# Altium schematic sheet overallViewSchDoc.SchDoc
size Legal
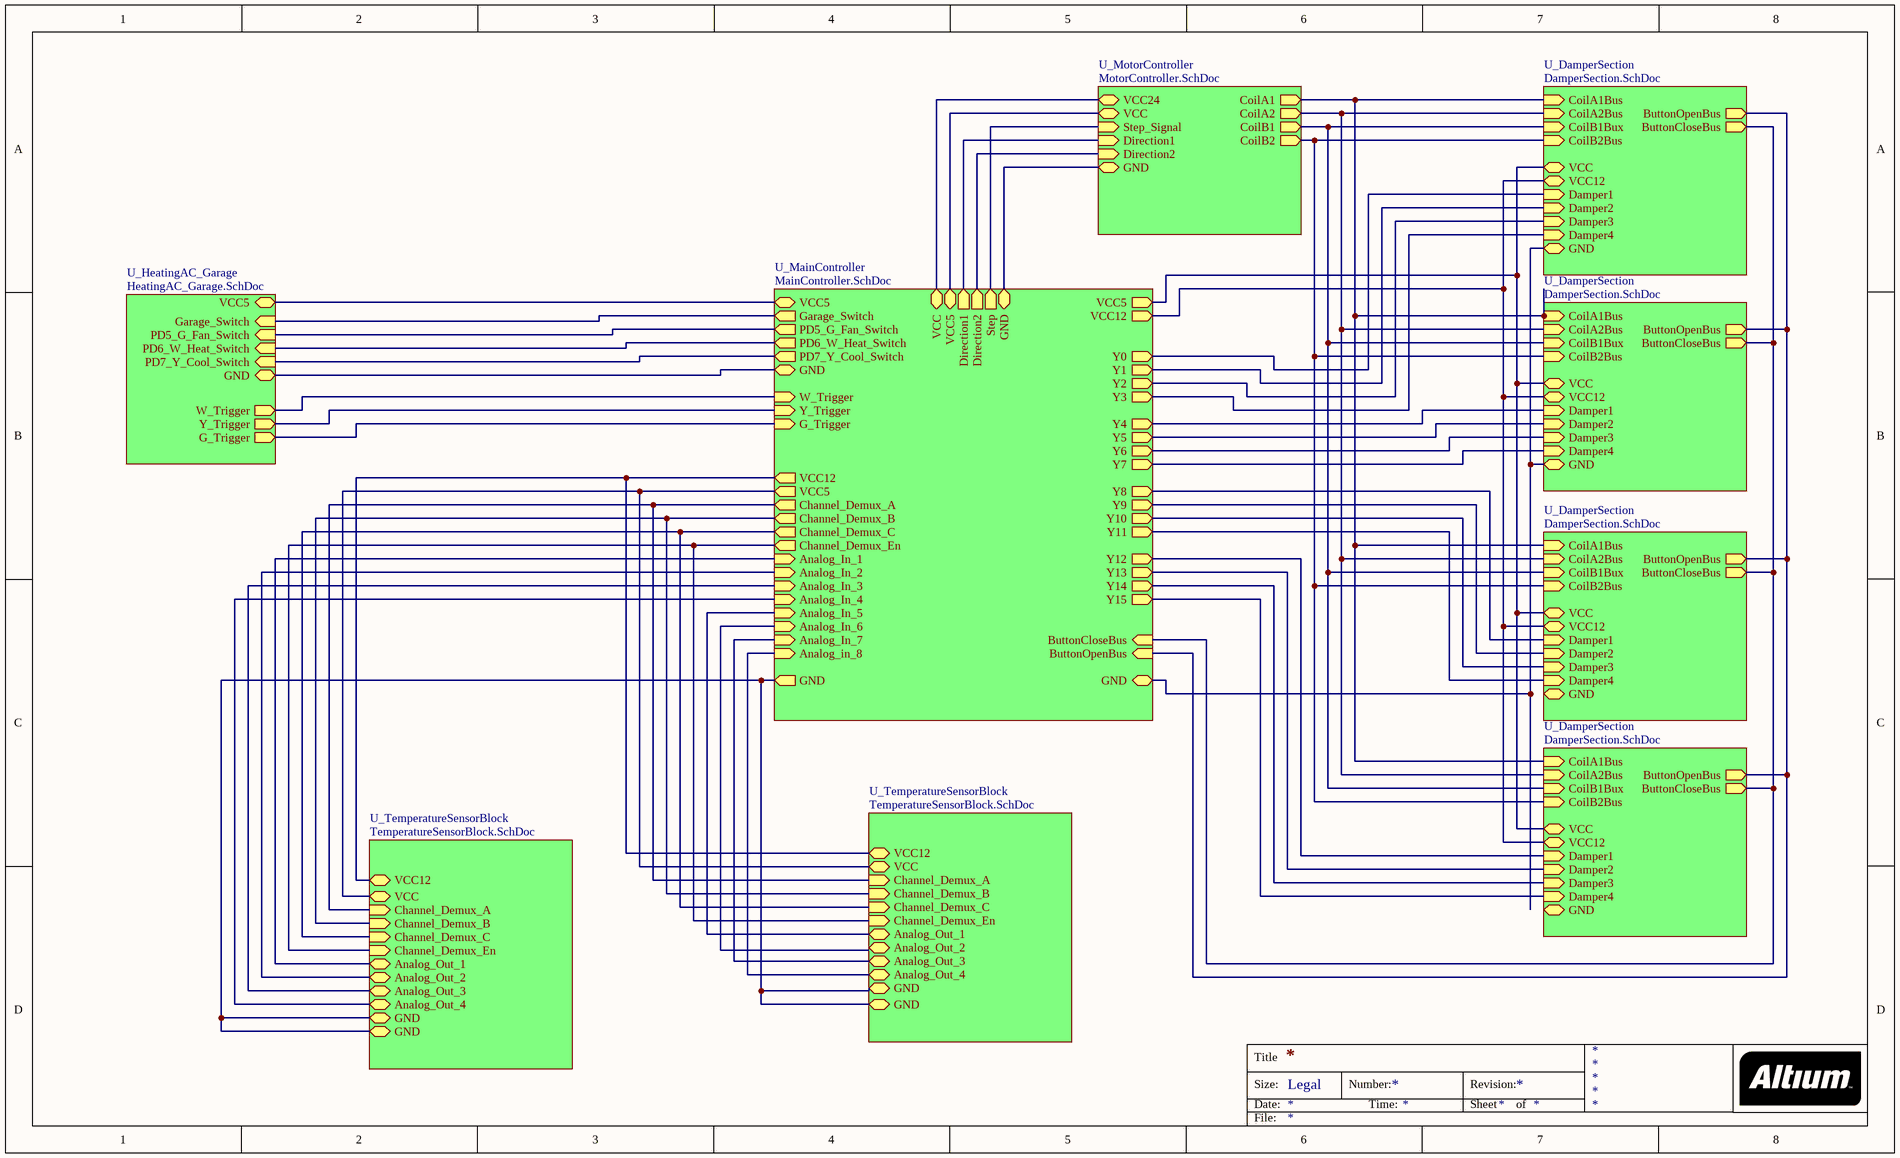
[diagram p0: overallViewSchDoc.SchDoc]

## Sub-sheets
U_DamperSection = DamperSection.SchDoc: CoilA1Bus (in), CoilA2Bus (in), CoilB1Bux (in), CoilB2Bus (in), VCC (bidir), VCC12 (bidir), ButtonOpenBus (out), ButtonCloseBus (out), Damper1 (in), Damper2 (in), Damper3 (in), Damper4 (in), GND (bidir)
U_DamperSection = DamperSection.SchDoc: CoilA1Bus (in), CoilA2Bus (in), CoilB1Bux (in), CoilB2Bus (in), VCC (bidir), VCC12 (bidir), ButtonOpenBus (out), ButtonCloseBus (out), Damper1 (in), Damper2 (in), Damper3 (in), Damper4 (in), GND (bidir)
U_DamperSection = DamperSection.SchDoc: CoilA1Bus (in), CoilA2Bus (in), CoilB1Bux (in), CoilB2Bus (in), VCC (bidir), VCC12 (bidir), ButtonOpenBus (out), ButtonCloseBus (out), Damper1 (in), Damper2 (in), Damper3 (in), Damper4 (in), GND (bidir)
U_DamperSection = DamperSection.SchDoc: CoilA1Bus (in), CoilA2Bus (in), CoilB1Bux (in), CoilB2Bus (in), VCC (bidir), VCC12 (bidir), ButtonOpenBus (out), ButtonCloseBus (out), Damper1 (in), Damper2 (in), Damper3 (in), Damper4 (in), GND (bidir)
U_HeatingAC_Garage = HeatingAC_Garage.SchDoc: VCC5 (bidir), Garage_Switch (in), PD5_G_Fan_Switch (in), PD6_W_Heat_Switch (in), PD7_Y_Cool_Switch (in), GND (bidir), W_Trigger (out), Y_Trigger (out), G_Trigger (out)
U_MainController = MainController.SchDoc: VCC5 (bidir), Garage_Switch (out), PD5_G_Fan_Switch (out), PD6_W_Heat_Switch (out), PD7_Y_Cool_Switch (out), GND (bidir), W_Trigger (in), Y_Trigger (in), G_Trigger (in), ButtonCloseBus (in), VCC (bidir), VCC5 (bidir), Direction1 (out), Direction2 (out), Step (out), GND (bidir), VCC5 (out), VCC12 (out), Y0 (out), Y2 (out), Y3 (out), Y1 (out), Y4 (out), Y5 (out), Y6 (out), Y7 (out), Y8 (out), Y9 (out), Y10 (out), Y11 (out), Y12 (out), Y13 (out), Y14 (out), Y15 (out), ButtonOpenBus (in), GND (bidir), VCC12 (out), VCC5 (out), Channel_Demux_A (out), Channel_Demux_B (out), Channel_Demux_C (out), Channel_Demux_En (out), Analog_In_1 (in), Analog_In_2 (in), Analog_In_3 (in), Analog_In_4 (in), Analog_In_5 (in), Analog_In_6 (in), Analog_In_7 (in), Analog_in_8 (in), GND (out)
U_MotorController = MotorController.SchDoc: VCC24 (bidir), VCC (bidir), Step_Signal (in), Direction1 (in), Direction2 (in), GND (bidir), CoilA1 (out), CoilA2 (out), CoilB1 (out), CoilB2 (out)
U_TemperatureSensorBlock = TemperatureSensorBlock.SchDoc: VCC (bidir), VCC12 (bidir), Channel_Demux_A (in), Channel_Demux_B (in), Channel_Demux_C (in), Channel_Demux_En (in), Analog_Out_1 (bidir), Analog_Out_2 (bidir), Analog_Out_3 (bidir), Analog_Out_4 (bidir), GND (bidir), GND (bidir)
U_TemperatureSensorBlock = TemperatureSensorBlock.SchDoc: VCC (bidir), VCC12 (bidir), Channel_Demux_A (in), Channel_Demux_B (in), Channel_Demux_C (in), Channel_Demux_En (in), Analog_Out_1 (bidir), Analog_Out_2 (bidir), Analog_Out_3 (bidir), Analog_Out_4 (bidir), GND (bidir), GND (bidir)

## Nets
(unnamed): sheet U_MainController/VCC5, sheet U_HeatingAC_Garage/VCC5
(unnamed): sheet U_MainController/Garage_Switch, sheet U_HeatingAC_Garage/Garage_Switch
(unnamed): sheet U_MainController/PD5_G_Fan_Switch, sheet U_HeatingAC_Garage/PD5_G_Fan_Switch
(unnamed): sheet U_MainController/PD6_W_Heat_Switch, sheet U_HeatingAC_Garage/PD6_W_Heat_Switch
(unnamed): sheet U_MainController/PD7_Y_Cool_Switch, sheet U_HeatingAC_Garage/PD7_Y_Cool_Switch
(unnamed): sheet U_MainController/GND, sheet U_HeatingAC_Garage/GND
(unnamed): sheet U_MainController/W_Trigger, sheet U_HeatingAC_Garage/W_Trigger
(unnamed): sheet U_MainController/Y_Trigger, sheet U_HeatingAC_Garage/Y_Trigger
(unnamed): sheet U_MainController/G_Trigger, sheet U_HeatingAC_Garage/G_Trigger
(unnamed): sheet U_MainController/ButtonCloseBus, sheet U_DamperSection/ButtonCloseBus, sheet U_DamperSection/ButtonCloseBus, sheet U_DamperSection/ButtonCloseBus, sheet U_DamperSection/ButtonCloseBus
(unnamed): sheet U_MainController/VCC, sheet U_MotorController/VCC24
(unnamed): sheet U_MainController/VCC5, sheet U_MotorController/VCC
(unnamed): sheet U_MainController/Direction1, sheet U_MotorController/Direction1
(unnamed): sheet U_MainController/Direction2, sheet U_MotorController/Direction2
(unnamed): sheet U_MainController/Step, sheet U_MotorController/Step_Signal
(unnamed): sheet U_MainController/GND, sheet U_MotorController/GND
(unnamed): sheet U_MainController/VCC5, sheet U_DamperSection/VCC, sheet U_DamperSection/VCC, sheet U_DamperSection/VCC, sheet U_DamperSection/VCC
(unnamed): sheet U_MainController/VCC12, sheet U_DamperSection/VCC12, sheet U_DamperSection/VCC12, sheet U_DamperSection/VCC12, sheet U_DamperSection/VCC12
(unnamed): sheet U_MainController/Y0, sheet U_DamperSection/Damper1
(unnamed): sheet U_MainController/Y2, sheet U_DamperSection/Damper3
(unnamed): sheet U_MainController/Y3, sheet U_DamperSection/Damper4
(unnamed): sheet U_MainController/Y1, sheet U_DamperSection/Damper2
(unnamed): sheet U_MainController/Y4, sheet U_DamperSection/Damper1
(unnamed): sheet U_MainController/Y5, sheet U_DamperSection/Damper2
(unnamed): sheet U_MainController/Y6, sheet U_DamperSection/Damper3
(unnamed): sheet U_MainController/Y7, sheet U_DamperSection/Damper4
(unnamed): sheet U_MainController/Y8, sheet U_DamperSection/Damper1
(unnamed): sheet U_MainController/Y9, sheet U_DamperSection/Damper2
(unnamed): sheet U_MainController/Y10, sheet U_DamperSection/Damper3
(unnamed): sheet U_MainController/Y11, sheet U_DamperSection/Damper4
(unnamed): sheet U_MainController/Y12, sheet U_DamperSection/Damper1
(unnamed): sheet U_MainController/Y13, sheet U_DamperSection/Damper2
(unnamed): sheet U_MainController/Y14, sheet U_DamperSection/Damper3
(unnamed): sheet U_MainController/Y15, sheet U_DamperSection/Damper4
(unnamed): sheet U_MainController/ButtonOpenBus, sheet U_DamperSection/ButtonOpenBus, sheet U_DamperSection/ButtonOpenBus, sheet U_DamperSection/ButtonOpenBus, sheet U_DamperSection/ButtonOpenBus
(unnamed): sheet U_MainController/GND, sheet U_DamperSection/GND, sheet U_DamperSection/GND
(unnamed): sheet U_MainController/VCC12, sheet U_TemperatureSensorBlock/VCC12, sheet U_TemperatureSensorBlock/VCC12
(unnamed): sheet U_MainController/VCC5, sheet U_TemperatureSensorBlock/VCC, sheet U_TemperatureSensorBlock/VCC
(unnamed): sheet U_MainController/Channel_Demux_A, sheet U_TemperatureSensorBlock/Channel_Demux_A, sheet U_TemperatureSensorBlock/Channel_Demux_A
(unnamed): sheet U_MainController/Channel_Demux_B, sheet U_TemperatureSensorBlock/Channel_Demux_B, sheet U_TemperatureSensorBlock/Channel_Demux_B
(unnamed): sheet U_MainController/Channel_Demux_C, sheet U_TemperatureSensorBlock/Channel_Demux_C, sheet U_TemperatureSensorBlock/Channel_Demux_C
(unnamed): sheet U_MainController/Channel_Demux_En, sheet U_TemperatureSensorBlock/Channel_Demux_En, sheet U_TemperatureSensorBlock/Channel_Demux_En
(unnamed): sheet U_MainController/Analog_In_1, sheet U_TemperatureSensorBlock/Analog_Out_1
(unnamed): sheet U_MainController/Analog_In_2, sheet U_TemperatureSensorBlock/Analog_Out_2
(unnamed): sheet U_MainController/Analog_In_3, sheet U_TemperatureSensorBlock/Analog_Out_3
(unnamed): sheet U_MainController/Analog_In_4, sheet U_TemperatureSensorBlock/Analog_Out_4
(unnamed): sheet U_MainController/Analog_In_5, sheet U_TemperatureSensorBlock/Analog_Out_1
(unnamed): sheet U_MainController/Analog_In_7, sheet U_TemperatureSensorBlock/Analog_Out_3
(unnamed): sheet U_MainController/Analog_in_8, sheet U_TemperatureSensorBlock/Analog_Out_4
(unnamed): sheet U_MainController/GND, sheet U_TemperatureSensorBlock/GND, sheet U_TemperatureSensorBlock/GND, sheet U_TemperatureSensorBlock/GND, sheet U_TemperatureSensorBlock/GND
(unnamed): sheet U_DamperSection/CoilA1Bus, sheet U_MotorController/CoilA1, sheet U_DamperSection/CoilA1Bus, sheet U_DamperSection/CoilA1Bus, sheet U_DamperSection/CoilA1Bus
(unnamed): sheet U_DamperSection/CoilA2Bus, sheet U_MotorController/CoilA2, sheet U_DamperSection/CoilA2Bus, sheet U_DamperSection/CoilA2Bus, sheet U_DamperSection/CoilA2Bus
(unnamed): sheet U_DamperSection/CoilB1Bux, sheet U_MotorController/CoilB1, sheet U_DamperSection/CoilB1Bux, sheet U_DamperSection/CoilB1Bux, sheet U_DamperSection/CoilB1Bux
(unnamed): sheet U_DamperSection/CoilB2Bus, sheet U_MotorController/CoilB2, sheet U_DamperSection/CoilB2Bus, sheet U_DamperSection/CoilB2Bus, sheet U_DamperSection/CoilB2Bus

## Notes on the sheet
- Title
- Size:
- Date:
- Legal
- Number:
- Time:
- Revision:
- Sheet
- of
- File: